# Altium schematic sheet relay_module.SchDoc
size A4
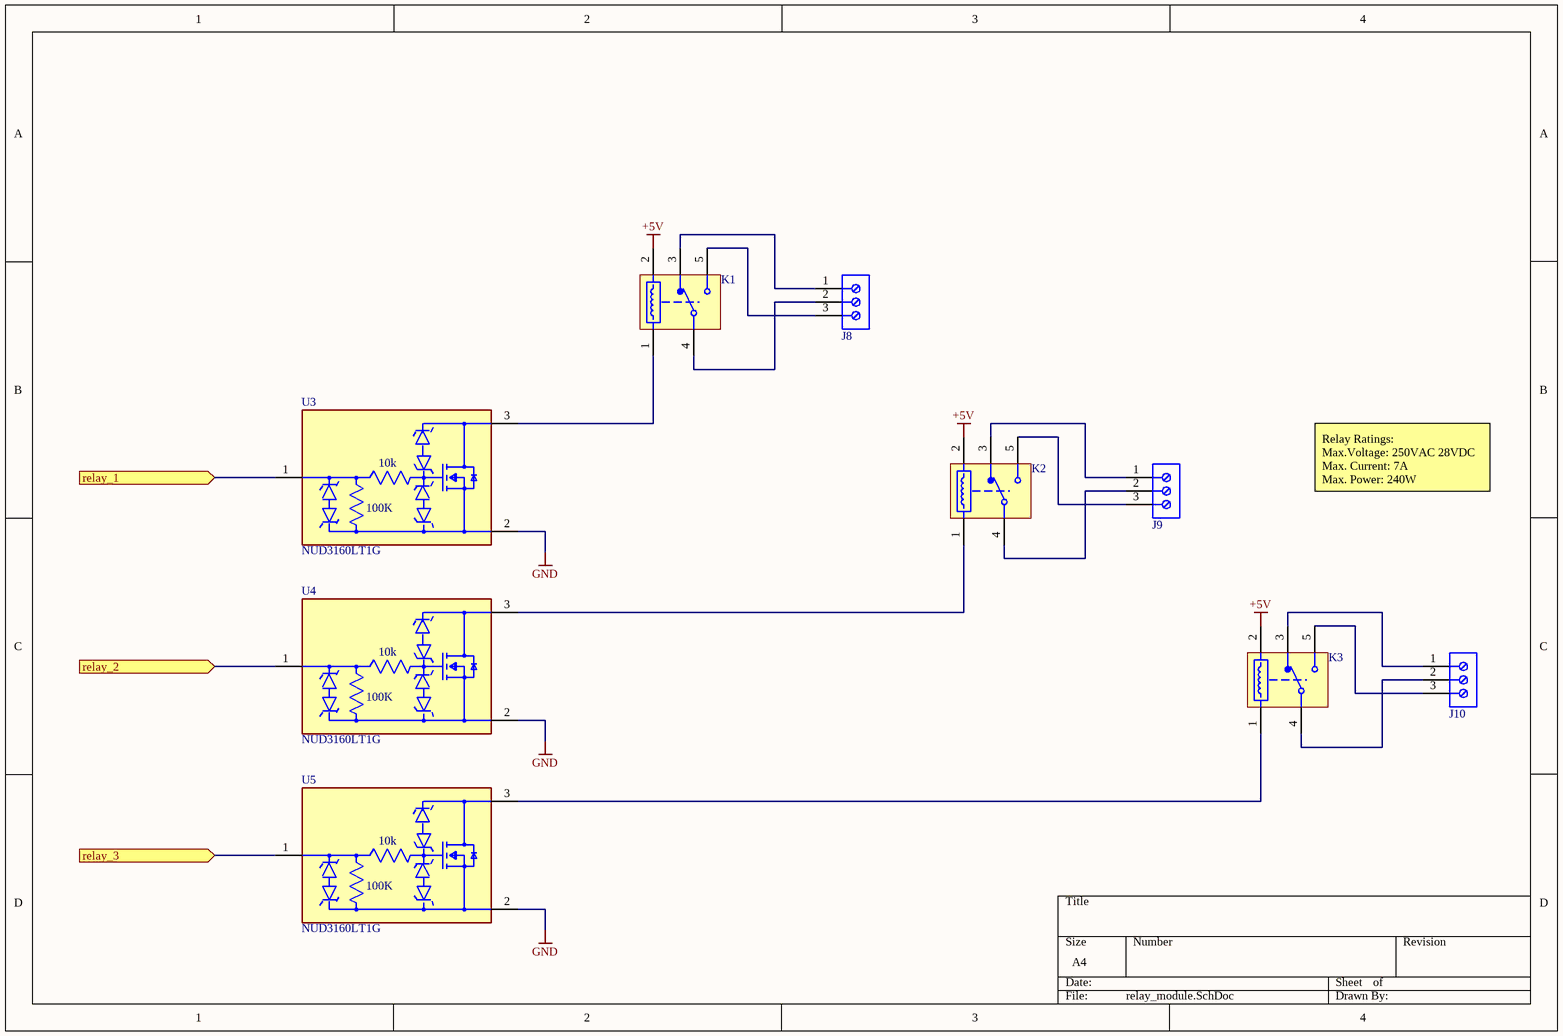
[diagram p0: relay_module.SchDoc]

## Parts
J8  282836-3  [TE_282836-3]  (value not drawn)
J9  282836-3  [TE_282836-3]  (value not drawn)
J10  282836-3  [TE_282836-3]  (value not drawn)
K1  RELAY_SRD-05VDC-SL-C  [SRD-05-VDC-SL-C]  (value not drawn)
K2  RELAY_SRD-05VDC-SL-C  [SRD-05-VDC-SL-C]  (value not drawn)
K3  RELAY_SRD-05VDC-SL-C  [SRD-05-VDC-SL-C]  (value not drawn)
U3  NUD3160LT1G  [FP-318-08-MFG]
U4  NUD3160LT1G  [FP-318-08-MFG]
U5  NUD3160LT1G  [FP-318-08-MFG]

## Ports
relay_1 (in), relay_2 (in), relay_3 (in)

## Nets
+5V: K1.2 K2.2 K3.2
GND: U3.2(Source) U4.2(Source) U5.2(Source)
relay_1: U3.1(Gate) ; port relay_1
relay_2: U4.1(Gate) ; port relay_2
relay_3: U5.1(Gate) ; port relay_3
NetJ8_1: J8.1 K1.3(NC)
NetJ8_2: J8.2 K1.4(COM)
NetJ8_3: J8.3 K1.5(NO)
NetJ9_1: J9.1 K2.3(NC)
NetJ9_2: J9.2 K2.4(COM)
NetJ9_3: J9.3 K2.5(NO)
NetJ10_1: J10.1 K3.3(NC)
NetJ10_2: J10.2 K3.4(COM)
NetJ10_3: J10.3 K3.5(NO)
NetK1_1: K1.1 U3.3(Drain)
NetK2_1: K2.1 U4.3(Drain)
NetK3_1: K3.1 U5.3(Drain)

## Notes on the sheet
- Relay Ratings:
  Max.Voltage: 250VAC 28VDC
  Max. Current: 7A
  Max. Power: 240W
- (in symbol CMP-07123-000002-1) 10k; 100K

## Library data of the parts
J8-J10 = 282836-3: Connector, Terminal Block; Wire Receptacle; 3 Pos.; 16-30 AWG; 0.197 in. CL; Sid; Manufacturer: TE Connectivity; Plating: Brass; Number of Levels: 1; Number of Positions Per Level: 3; Current: 13.5A; Voltage: 300V; Closed End: No (Without); Interlock: Yes (With); Voltage Rating (AC): 250V; Pitch: 5mm; Wire Gauge (Max): 30AWG; Wire Gauge (Min): 16AWG; Tail Length: 3.5mm; Thread Size: M3; Approvals: UL; Supplier 1: Mouser; Manufacturer Part Number: 282836-3; RoHS: Yes; Category: Terminal Blocks; Stock 1: 394; Pricing 1: 1=0.96000, 10=0.57500, 50=0.57500, 100=0.48300, 600=0.45700, 1000=0.40600, 2600=0.36800, 4800=0.33000, 10000=0.33000, 11200=0.31700, 25600=0.31100 (USD); Mount: Through Hole,Board; Housing Color: Green; Contact Plating: Tin; Contact Material: Brass; Color: Green; Housing Material: Polyamide; Insulation Material: Nylon; Number of Rows: 1; Termination: Screw; Package Quantity: 200; Packaging: Bulk; Number of Positions: 3; Orientation: Straight; Series: Buchanan; Connector Type: Receptacle; Number of Contacts: 3; Screw Flange: No (Without); Screwless Terminal Block: No (Without); Side Stackable: Yes (With); Current Rating: 13.5A; Max Current Rating: 13.5A; Voltage Rating: 300V; Number of Circuits: 3; Max Supply Voltage (AC): 300V; Number of Poles: 3; Max Voltage Rating (AC): 300V; RMS Current (Irms): 13.5A; Working Voltage: 250V; Length: 15mm; Width: 10mm; Depth: 8.2mm; Wire/Cable Gauge: 16AWG; Radiation Hardening: No; Flammability Rating: UL94 V-0; RoHS Compliant: Yes; ELV: Compliant; REACH SVHC: Unknown; Lead Free: Lead Free; ComponentLink1URL: https://datasheet.ciiva.com/15169/getdatasheetpartid-155856-15169554.pdf?src-supplier=Verical; ComponentLink1Description: https://datasheet.ciiva.com/15169/getdatasheetpartid-155856-15169554.pdf?src-supplier=Verical; ComponentLink2URL: https://datasheet.ciiva.com/16305/eng-cs-1308389-eurostyle-terminal-blocks-0607-16305242.pdf?src-supplier=Future+Electronics; ComponentLink2Description: https://datasheet.ciiva.com/16305/eng-cs-1308389-eurostyle-terminal-blocks-0607-16305242.pdf?src-supplier=Future+Electronics; ComponentLink3URL: https://datasheet.ciiva.com/19460/750661-19460522.pdf?src-supplier=Jameco; ComponentLink3Description: https://datasheet.ciiva.com/19460/750661-19460522.pdf?src-supplier=Jameco; ComponentLink4URL: https://datasheet.ciiva.com/11757/0900766b8002dc8a-11757406.pdf?src-supplier=RSComponents; ComponentLink4Description: https://datasheet.ciiva.com/11757/0900766b8002dc8a-11757406.pdf?src-supplier=RSComponents; ComponentLink5URL: https://datasheet.ciiva.com/823/eng-cd-282836-h10-823445.pdf?src-supplier=Digi-Key; ComponentLink5Description: https://datasheet.ciiva.com/823/eng-cd-282836-h10-823445.pdf?src-supplier=Digi-Key; ComponentLink6URL: https://datasheet.ciiva.com/30106/eng-cs-1308389-eurostyle-terminal-blocks-0607-30106198.pdf?src-supplier=Onlinecomponents.com; ComponentLink6Description: https://datasheet.ciiva.com/30106/eng-cs-1308389-eurostyle-terminal-blocks-0607-30106198.pdf?src-supplier=Onlinecomponents.com; ComponentLink7URL: https://datasheet.ciiva.com/14606/70086276-14606907.pdf?src-supplier=Allied+Electronics; ComponentLink7Description: https://datasheet.ciiva.com/14606/70086276-14606907.pdf?src-supplier=Allied+Electronics; ComponentLink8URL: https://datasheet.ciiva.com/16649/eng-cs-1308389-eurostyle-terminal-blocks-0607-16649389.pdf?src-supplier=Avnet+Europe; ComponentLink8Description: https://datasheet.ciiva.com/16649/eng-cs-1308389-eurostyle-terminal-blocks-0607-16649389.pdf?src-supplier=Avnet+Europe; ComponentLink9URL: https://datasheet.ciiva.com/3141/eng-cs-1308389-eurostyle-terminal-blocks-0607-3141119.pdf?src-supplier=Avnet; ComponentLink9Description: https://datasheet.ciiva.com/3141/eng-cs-1308389-eurostyle-terminal-blocks-0607-3141119.pdf?src-supplier=Avnet; Supplier Part Number 1: 571-2828363
K1-K3 = RELAY_SRD-05VDC-SL-C: 5VDC SPDT Relay; Switching power: 240W; Max. AC current: 3A; Max. DC current: 7A; ca: 7A
U3-U5 = CMP-07123-000002-1: IC INDCT LOAD DRVR INDUST SOT23; Manufacturer: ON Semiconductor; Max Power Dissipation: 225mW; Fall Time: 622ns; Max Supply Voltage: 60V; Propagation Delay: 1160ns; Output Current: 150mA; Output Voltage: 48V; Standoff Height: 0.01mm; Number Of Outputs: 1; Max Junction Temp: +150°C; Rise Time: 600ns; Temperature Range Low: -40°C; Mouser Description: MOSFET 61V Industrial Load Driver; Ambient Temperature Range High: +125°C; Octopart: https://octopart.com/nud3160lt1g-on+semiconductor-470723; Package: 318-08; Automotive: No; Temperature: -40°C to +150°C; RoHS: TRUE; Lead Free: Yes; Height: 1.11mm; Device Class L3: Gate Drivers; Ambient Temperature Range Low: -40°C; Device Class L2: Power Management ICs; Digikey Description: IC INDCT LOAD DRVR INDUST SOT23; Category: IC; Device Class L1: Integrated Circuits (ICs); Manufacturer Part Number: NUD3160LT1G; Footprint Url: https://www.onsemi.com/pub/Collateral/318-08.PDF; Number Of Drivers: 1; ComponentLink2Description: Datasheet; Temperature Range High: +150°C; ComponentLink2URL: https://www.onsemi.com/pub/Collateral/NUD3160-D.PDF